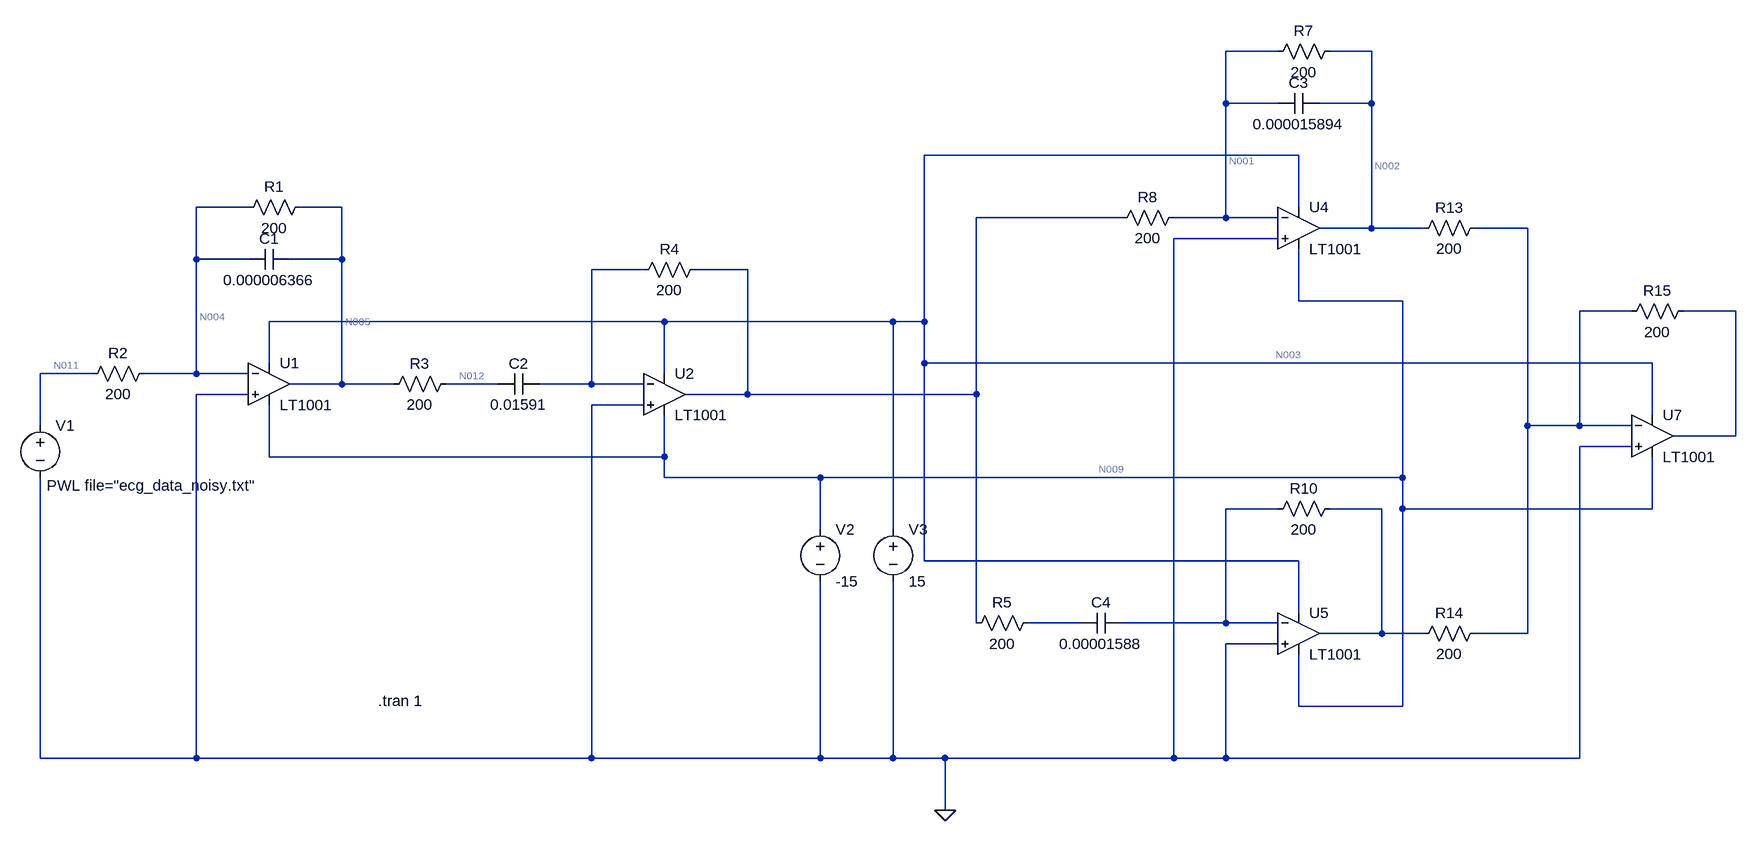
[diagram p0: schematic filter.asc]
filter.asc, the LTspice schematic file:
Version 4
SHEET 1 4612 2132
WIRE 2128 -544 2048 -544
WIRE 2272 -544 2208 -544
WIRE 2048 -464 2048 -544
WIRE 2128 -464 2048 -464
WIRE 2272 -464 2272 -544
WIRE 2272 -464 2192 -464
WIRE 2160 -384 1584 -384
WIRE 544 -304 464 -304
WIRE 688 -304 624 -304
WIRE 2160 -304 2160 -384
WIRE 1888 -288 1664 -288
WIRE 2048 -288 2048 -464
WIRE 2048 -288 1968 -288
WIRE 2128 -288 2048 -288
WIRE 2272 -272 2272 -464
WIRE 2272 -272 2192 -272
WIRE 2352 -272 2272 -272
WIRE 2512 -272 2432 -272
WIRE 2128 -256 1968 -256
WIRE 464 -224 464 -304
WIRE 544 -224 464 -224
WIRE 688 -224 688 -304
WIRE 688 -224 608 -224
WIRE 1152 -208 1072 -208
WIRE 1312 -208 1232 -208
WIRE 2160 -160 2160 -240
WIRE 2320 -160 2160 -160
WIRE 2672 -144 2592 -144
WIRE 2832 -144 2752 -144
WIRE 1184 -128 576 -128
WIRE 1536 -128 1184 -128
WIRE 1584 -128 1584 -384
WIRE 1584 -128 1536 -128
WIRE 576 -64 576 -128
WIRE 1584 -64 1584 -128
WIRE 2704 -64 1584 -64
WIRE 304 -48 224 -48
WIRE 464 -48 464 -224
WIRE 464 -48 384 -48
WIRE 544 -48 464 -48
WIRE 1184 -48 1184 -128
WIRE 688 -32 688 -224
WIRE 688 -32 608 -32
WIRE 768 -32 688 -32
WIRE 928 -32 848 -32
WIRE 1072 -32 1072 -208
WIRE 1072 -32 992 -32
WIRE 1152 -32 1072 -32
WIRE 544 -16 464 -16
WIRE 1312 -16 1312 -208
WIRE 1312 -16 1216 -16
WIRE 1664 -16 1664 -288
WIRE 1664 -16 1312 -16
WIRE 1152 0 1072 0
WIRE 2704 16 2704 -64
WIRE 224 32 224 -48
WIRE 2512 32 2512 -272
WIRE 2592 32 2592 -144
WIRE 2592 32 2512 32
WIRE 2672 32 2592 32
WIRE 2832 48 2832 -144
WIRE 2832 48 2736 48
WIRE 2672 64 2592 64
WIRE 576 80 576 0
WIRE 1184 80 1184 16
WIRE 1184 80 576 80
WIRE 1184 112 1184 80
WIRE 1424 112 1184 112
WIRE 2320 112 2320 -160
WIRE 2320 112 1424 112
WIRE 2128 160 2048 160
WIRE 2288 160 2208 160
WIRE 2320 160 2320 112
WIRE 2704 160 2704 80
WIRE 2704 160 2320 160
WIRE 1424 192 1424 112
WIRE 1536 192 1536 -128
WIRE 1584 240 1584 -64
WIRE 2160 240 1584 240
WIRE 2160 320 2160 240
WIRE 1664 336 1664 -16
WIRE 1824 336 1744 336
WIRE 2048 336 2048 160
WIRE 2048 336 1888 336
WIRE 2128 336 2048 336
WIRE 2288 352 2288 160
WIRE 2288 352 2192 352
WIRE 2352 352 2288 352
WIRE 2512 352 2512 32
WIRE 2512 352 2432 352
WIRE 2128 368 2048 368
WIRE 2160 464 2160 384
WIRE 2320 464 2320 160
WIRE 2320 464 2160 464
WIRE 224 544 224 112
WIRE 464 544 464 -16
WIRE 464 544 224 544
WIRE 1072 544 1072 0
WIRE 1072 544 464 544
WIRE 1424 544 1424 272
WIRE 1424 544 1072 544
WIRE 1536 544 1536 272
WIRE 1536 544 1424 544
WIRE 1616 544 1536 544
WIRE 1968 544 1968 -256
WIRE 1968 544 1616 544
WIRE 2048 544 2048 368
WIRE 2048 544 1968 544
WIRE 2592 544 2592 64
WIRE 2592 544 2048 544
WIRE 1616 624 1616 544
FLAG 1616 624 0
SYMBOL voltage 224 16 R0
WINDOW 3 10 108 Left 2
WINDOW 123 0 0 Left 0
WINDOW 39 0 0 Left 0
SYMATTR Value PWL file="ecg_data_noisy.txt"
SYMATTR InstName V1
SYMBOL OpAmps\\LT1001 576 -96 R0
SYMATTR InstName U1
SYMBOL cap 608 -240 R90
WINDOW 0 0 32 VBottom 2
WINDOW 3 32 32 VTop 2
SYMATTR InstName C1
SYMATTR Value 0.000006366
SYMBOL res 528 -288 R270
WINDOW 0 32 56 VTop 2
WINDOW 3 0 56 VBottom 2
SYMATTR InstName R1
SYMATTR Value 200
SYMATTR SpiceLine tol=1 pwr=0.1
SYMBOL res 400 -64 R90
WINDOW 0 0 56 VBottom 2
WINDOW 3 32 56 VTop 2
SYMATTR InstName R2
SYMATTR Value 200
SYMATTR SpiceLine tol=1 pwr=0.1
SYMBOL res 864 -48 R90
WINDOW 0 0 56 VBottom 2
WINDOW 3 32 56 VTop 2
SYMATTR InstName R3
SYMATTR Value 200
SYMATTR SpiceLine tol=1 pwr=0.1
SYMBOL cap 992 -48 R90
WINDOW 0 0 32 VBottom 2
WINDOW 3 32 32 VTop 2
SYMATTR InstName C2
SYMATTR Value 0.01591
SYMBOL OpAmps\\LT1001 1184 -80 R0
SYMATTR InstName U2
SYMBOL res 1248 -224 R90
WINDOW 0 0 56 VBottom 2
WINDOW 3 32 56 VTop 2
SYMATTR InstName R4
SYMATTR Value 200
SYMATTR SpiceLine tol=1 pwr=0.1
SYMBOL voltage 1424 176 R0
WINDOW 123 0 0 Left 0
WINDOW 39 0 0 Left 0
SYMATTR InstName V2
SYMATTR Value -15
SYMBOL voltage 1536 176 R0
WINDOW 123 0 0 Left 0
WINDOW 39 0 0 Left 0
SYMATTR InstName V3
SYMATTR Value 15
SYMBOL OpAmps\\LT1001 2160 -336 R0
SYMATTR InstName U4
SYMBOL cap 2192 -480 R90
WINDOW 0 0 32 VBottom 2
WINDOW 3 32 32 VTop 2
SYMATTR InstName C3
SYMATTR Value 0.000015894
SYMBOL res 2112 -528 R270
WINDOW 0 32 56 VTop 2
WINDOW 3 0 56 VBottom 2
SYMATTR InstName R7
SYMATTR Value 200
SYMATTR SpiceLine tol=1 pwr=0.1
SYMBOL res 1984 -304 R90
WINDOW 0 0 56 VBottom 2
WINDOW 3 32 56 VTop 2
SYMATTR InstName R8
SYMATTR Value 200
SYMATTR SpiceLine tol=1 pwr=0.1
SYMBOL cap 1888 320 R90
WINDOW 0 0 32 VBottom 2
WINDOW 3 32 32 VTop 2
SYMATTR InstName C4
SYMATTR Value 0.00001588
SYMBOL OpAmps\\LT1001 2160 288 R0
SYMATTR InstName U5
SYMBOL res 2224 144 R90
WINDOW 0 0 56 VBottom 2
WINDOW 3 32 56 VTop 2
SYMATTR InstName R10
SYMATTR Value 200
SYMATTR SpiceLine tol=1 pwr=0.1
SYMBOL res 2448 -288 R90
WINDOW 0 0 56 VBottom 2
WINDOW 3 32 56 VTop 2
SYMATTR InstName R13
SYMATTR Value 200
SYMATTR SpiceLine tol=1 pwr=0.1
SYMBOL res 2448 336 R90
WINDOW 0 0 56 VBottom 2
WINDOW 3 32 56 VTop 2
SYMATTR InstName R14
SYMATTR Value 200
SYMATTR SpiceLine tol=1 pwr=0.1
SYMBOL OpAmps\\LT1001 2704 -16 R0
SYMATTR InstName U7
SYMBOL res 2768 -160 R90
WINDOW 0 0 56 VBottom 2
WINDOW 3 32 56 VTop 2
SYMATTR InstName R15
SYMATTR Value 200
SYMATTR SpiceLine tol=1 pwr=0.1
SYMBOL res 1760 320 R90
WINDOW 0 0 56 VBottom 2
WINDOW 3 32 56 VTop 2
SYMATTR InstName R5
SYMATTR Value 200
TEXT 744 456 Left 2 !.tran 1

The netlist it stands for:
* filter.asc
V1 N011 0 PWL file="ecg_data_noisy.txt"
XU1 0 N004 N003 N009 N005 LT1001  ; pins In+ In- V+ V- OUT
C1 N005 N004 0.000006366
R1 N004 N005 200 tol=1 pwr=0.1
R2 N004 N011 200 tol=1 pwr=0.1
R3 N012 N005 200 tol=1 pwr=0.1
C2 N008 N012 0.01591
XU2 0 N008 N003 N009 N006 LT1001  ; pins In+ In- V+ V- OUT
R4 N006 N008 200 tol=1 pwr=0.1
V2 N009 0 -15
V3 N003 0 15
XU4 0 N001 N003 N009 N002 LT1001  ; pins In+ In- V+ V- OUT
C3 N002 N001 0.000015894
R7 N001 N002 200 tol=1 pwr=0.1
R8 N001 N006 200 tol=1 pwr=0.1
C4 N013 N015 0.00001588
XU5 0 N013 N003 N009 N014 LT1001  ; pins In+ In- V+ V- OUT
R10 N014 N013 200 tol=1 pwr=0.1
R13 N007 N002 200 tol=1 pwr=0.1
R14 N007 N014 200 tol=1 pwr=0.1
XU7 0 N007 N003 N009 N010 LT1001  ; pins In+ In- V+ V- OUT
R15 N010 N007 200 tol=1 pwr=0.1
R5 N015 N006 200
.tran 1
.lib LTC.lib
.backanno
.end

* Results of the author's LTspice run, read from the files saved beside the schematic
* Operating Point, zero values left out:
*   V(n011) = -5.076 mV
*   V(n003) = 15 V
*   V(n009) = -15 V
*   V(n005) = 5.076 mV
*   V(n012) = 5.076 mV
*   I(R1) = -25.38 µA
*   I(R2) = 25.38 µA
*   I(V1) = 25.38 µA
*   I(V2) = 11.24 mA
*   I(V3) = -11.26 mA
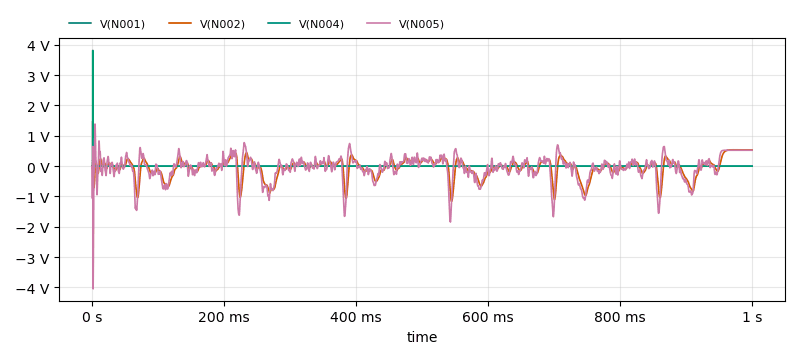
[diagram p1: Transient Analysis of filter.asc, plotted from the saved traces]
* Transient Analysis, 1 run:
*   V(N001): min -164.6 µV, max 366.4 µV, average -48.49 nV, rms 21.07 µV, last -914.6 nV
*   V(N002): min -1.161 V, max 538.6 mV, average -52.15 mV, rms 314.6 mV, last 534.7 mV
*   V(N004): min -1.826 mV, max 3.816 V, average 1.962 mV, rms 72.08 mV, last -933.3 nV
*   V(N005): min -4.043 V, max 1.389 V, average -57.48 mV, rms 406.7 mV, last 523.3 mV